# EAGLE design OpenRetroMGB (EAGLE 9.6.2)

## Sheet 1 of 8: Game Boy Card Slot
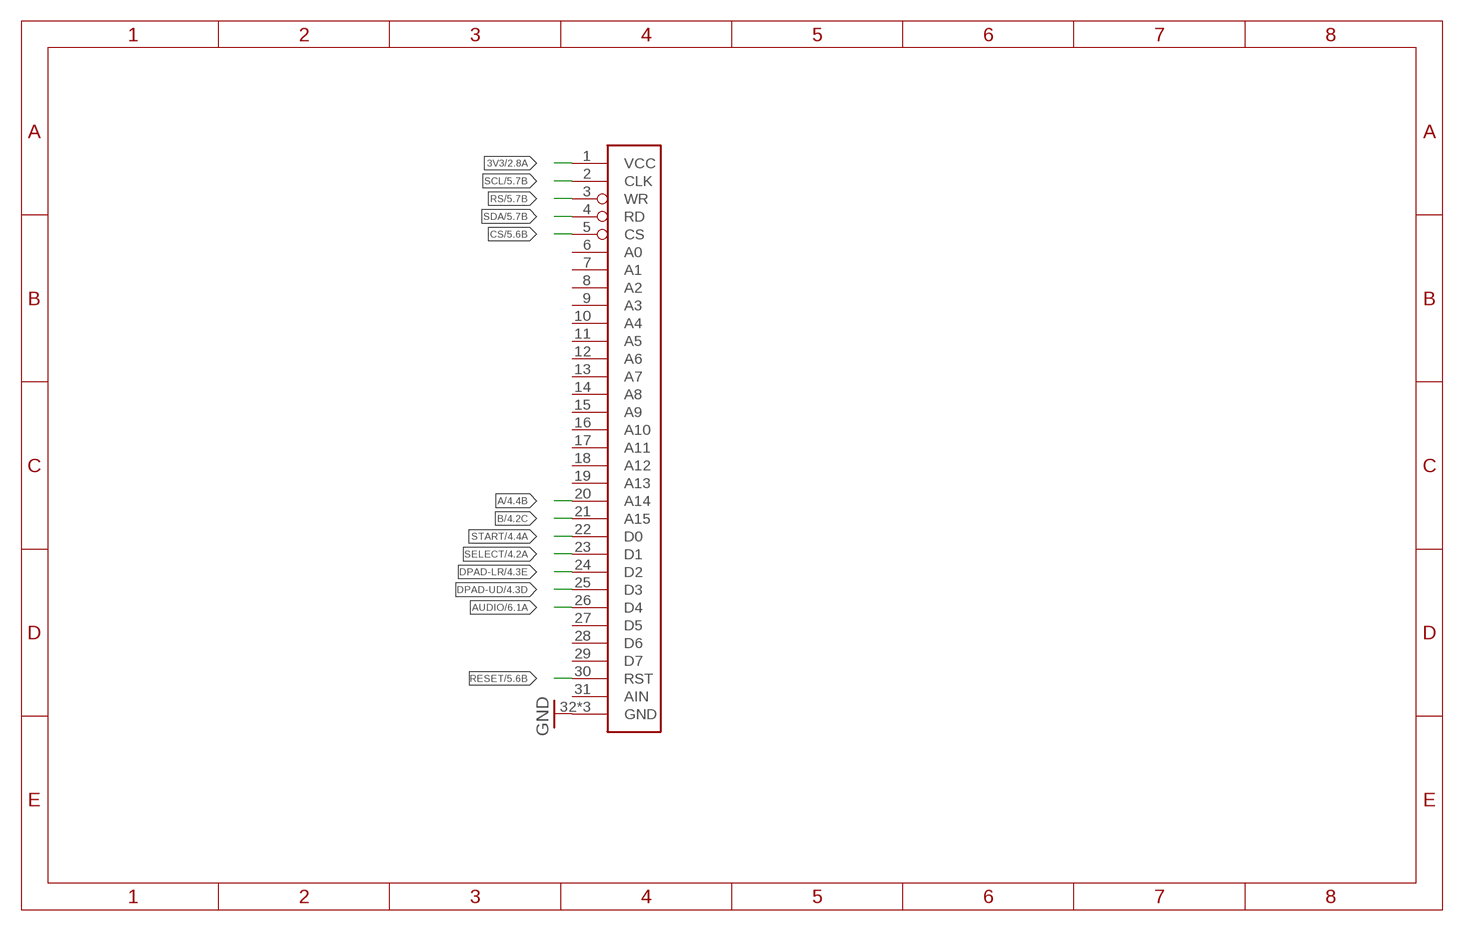
[diagram p0: schematic, sheet 1]

### Parts
U$2  GB-CARTRIDGE-SLOTV2  [GB-CARTRIDGE-SLOT-2]

### Nets
3V3: U$2.1(VCC) ; also sheet 2,4,5,6,7
A: U$2.20(A14) ; also sheet 4
AUDIO: U$2.26(D4) ; also sheet 6
B: U$2.21(A15) ; also sheet 4
CS: U$2.5(CS) ; also sheet 5
DPAD-LR: U$2.24(D2) ; also sheet 4
DPAD-UD: U$2.25(D3) ; also sheet 4
GND: U$2.32(GND) U$2.PAD1(GND) U$2.PAD2(GND) ; also sheet 2,3,4,5,6,7
RESET: U$2.30(RST) ; also sheet 5
RS: U$2.3(WR) ; also sheet 5
SCL: U$2.2(CLK) ; also sheet 5
SDA: U$2.4(RD) ; also sheet 5
SELECT: U$2.23(D1) ; also sheet 4
START: U$2.22(D0) ; also sheet 4
Unconnected: U$2.6(A0) U$2.7(A1) U$2.8(A2) U$2.9(A3) U$2.10(A4) U$2.11(A5) U$2.12(A6) U$2.13(A7) U$2.14(A8) U$2.15(A9) U$2.16(A10) U$2.17(A11) U$2.18(A12) U$2.19(A13) U$2.27(D5) U$2.28(D6) U$2.29(D7) U$2.31(AIN)

## Sheet 2 of 8: POWER (SOURCE, BATTERY, CHARGE, CONTROL)
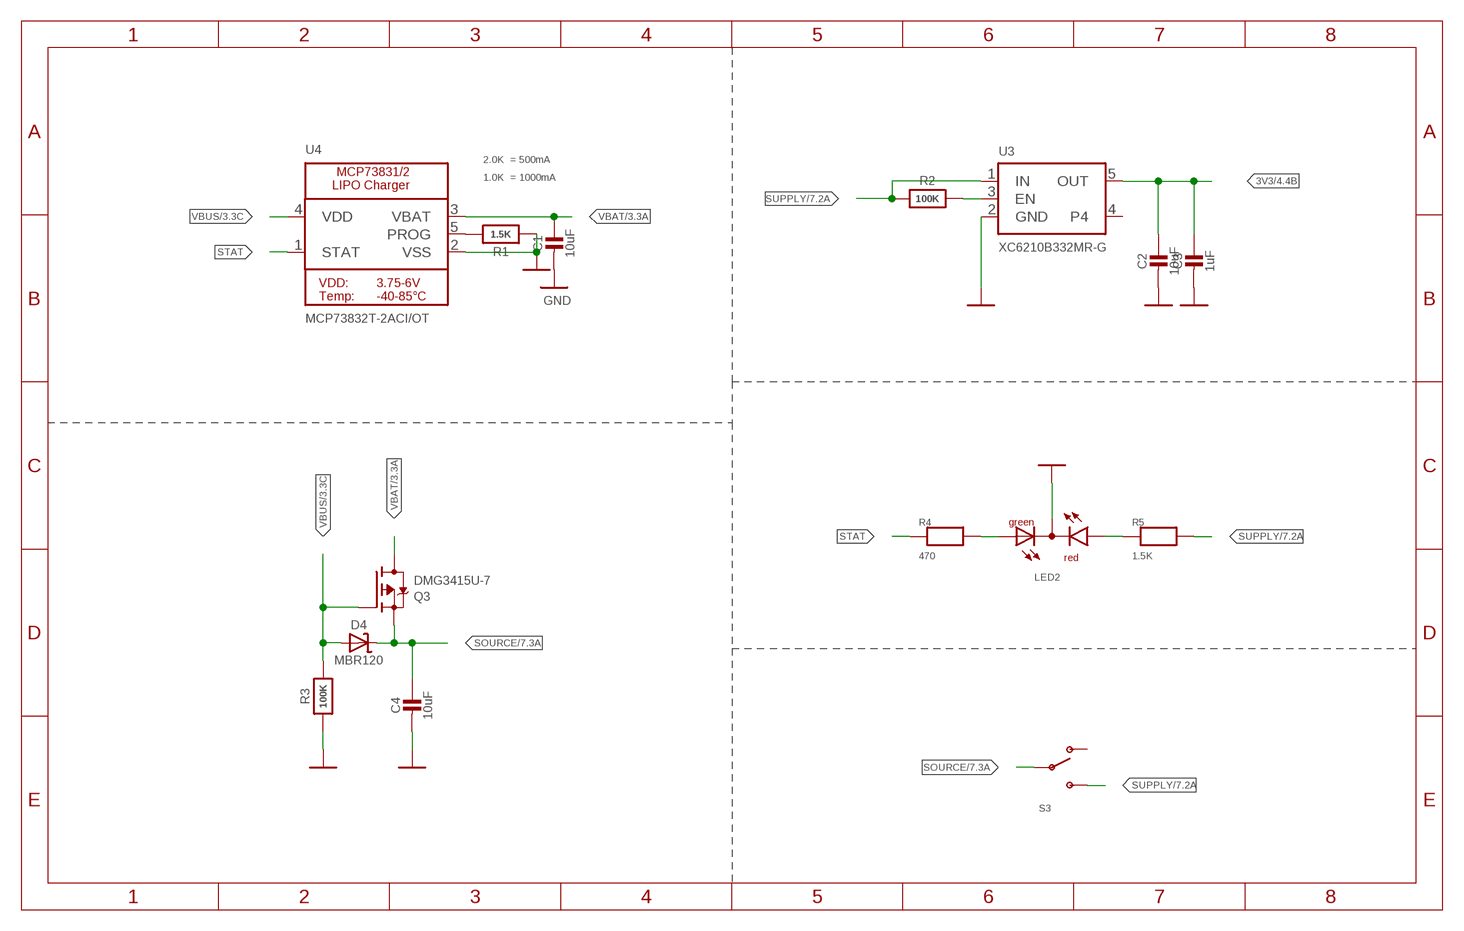
[diagram p1: schematic, sheet 2]

### Parts
C1  10uF  CAP_CERAMIC  [0603-MINI-CAP]
C2  10uF  CAP_CERAMIC  [0603-MINI-CAP]
C3  1uF  CAP_CERAMIC  [0603-MINI-CAP]
C4  10uF  CAP_CERAMIC  [0603-MINI-CAP]
D4  MBR120  DIODE-SCHOTTKYSOD-123  [SOD-123]
LED2  LED_L-115WEGW-CA  [LED_DUOLED-A-3MM]
Q3  DMG3415U-7  MOSFET-P  [SOT23-R]
R1  1.5K  RESISTOR0603MINI  [0603-MINI]
R2  100K  RESISTOR0603MINI  [0603-MINI]
R3  100K  RESISTOR0603MINI  [0603-MINI]
R4  470  RESISTOR0603MINI  [0603-MINI]
R5  1.5K  RESISTOR0603MINI  [0603-MINI]
S3  RETIRED_SWITCH_SPDT  [RETIRED_KPS-1290]
U3  XC6210B332MR-G  AP2112-3.3  [SOT23-5]
U4  MCP73832T-2ACI/OT  MCP73831/2  [SOT23-5-1]

### Nets
3V3: C2.1 C3.1 U3.5(OUT) ; also sheet 1,4,5,6,7
EN: R2.2 U3.3(EN)
GND: C1.2 C2.2 C3.2 C4.2 LED2.2(A) R1.1 R3.1 U3.2(GND) U4.2(VSS) ; also sheet 1,3,4,5,6,7
POWER_LED: LED2.3(CR) R5.1
PROG: R1.2 U4.5(PROG)
SOURCE: C4.1 D4.C Q3.2(S) S3.P ; also sheet 7
STAT: R4.1 U4.1(STAT)
STAT_LED: LED2.1(CG) R4.2
SUPPLY: R2.1 R5.2 S3.S U3.1(IN) ; also sheet 7
VBAT: C1.1 Q3.3(D) U4.3(VBAT) ; also sheet 3,7
VBUS: D4.A Q3.1(G) R3.2 U4.4(VDD) ; also sheet 3,7
Unconnected: S3.O U3.4

### Notes on the sheet
- 2.0K  = 500mA
- 1.0K  = 1000mA

## Sheet 3 of 8: USB + BATTERY
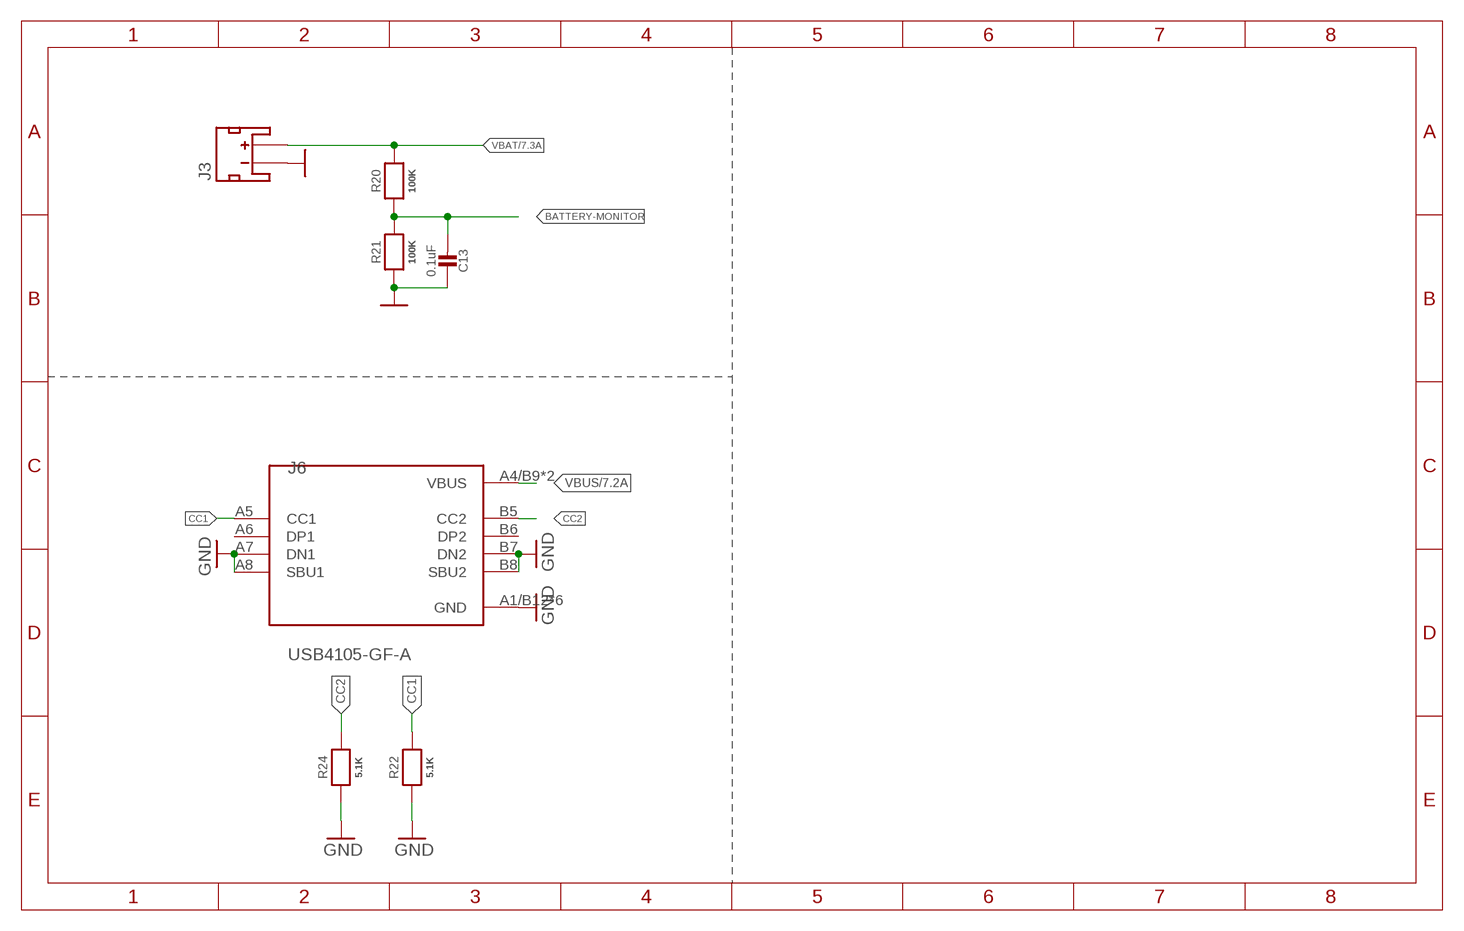
[diagram p2: schematic, sheet 3]

### Parts
C13  0.1uF  CAP_CERAMIC  [0603-MINI-CAP]
J3  Batt Conn  JST_2MM_MALE  [JST-2-SMD]
J6  USB4105-GF-A  [GCT_USB4105-GF-A]
R20  100K  RESISTOR0603MINI  [0603-MINI]
R21  100K  RESISTOR0603MINI  [0603-MINI]
R22  5.1K  RESISTOR0603MINI  [0603-MINI]
R24  5.1K  RESISTOR0603MINI  [0603-MINI]

### Nets
BATTERY-MONITOR: C13.2 R20.1 R21.2
CC1: J6.A5(CC1) R22.2
CC2: J6.B5(CC2) R24.2
GND: C13.1 J3.1(-) J6.A1/B12(GND) J6.A7(DN1) J6.A8(SBU1) J6.B1/A12(GND) J6.B7(DN2) J6.B8(SBU2) J6.G1(GND) J6.G2(GND) J6.G3(GND) J6.G4(GND) R21.1 R22.1 R24.1 ; also sheet 1,2,4,5,6,7
VBAT: J3.2(+) R20.2 ; also sheet 2,7
VBUS: J6.A4/B9(VBUS) J6.B4/A9(VBUS) ; also sheet 2,7
Unconnected: J3.NC1(PAD1) J3.NC2(PAD2) J6.A6(DP1) J6.B6(DP2)

## Sheet 4 of 8: GPIO
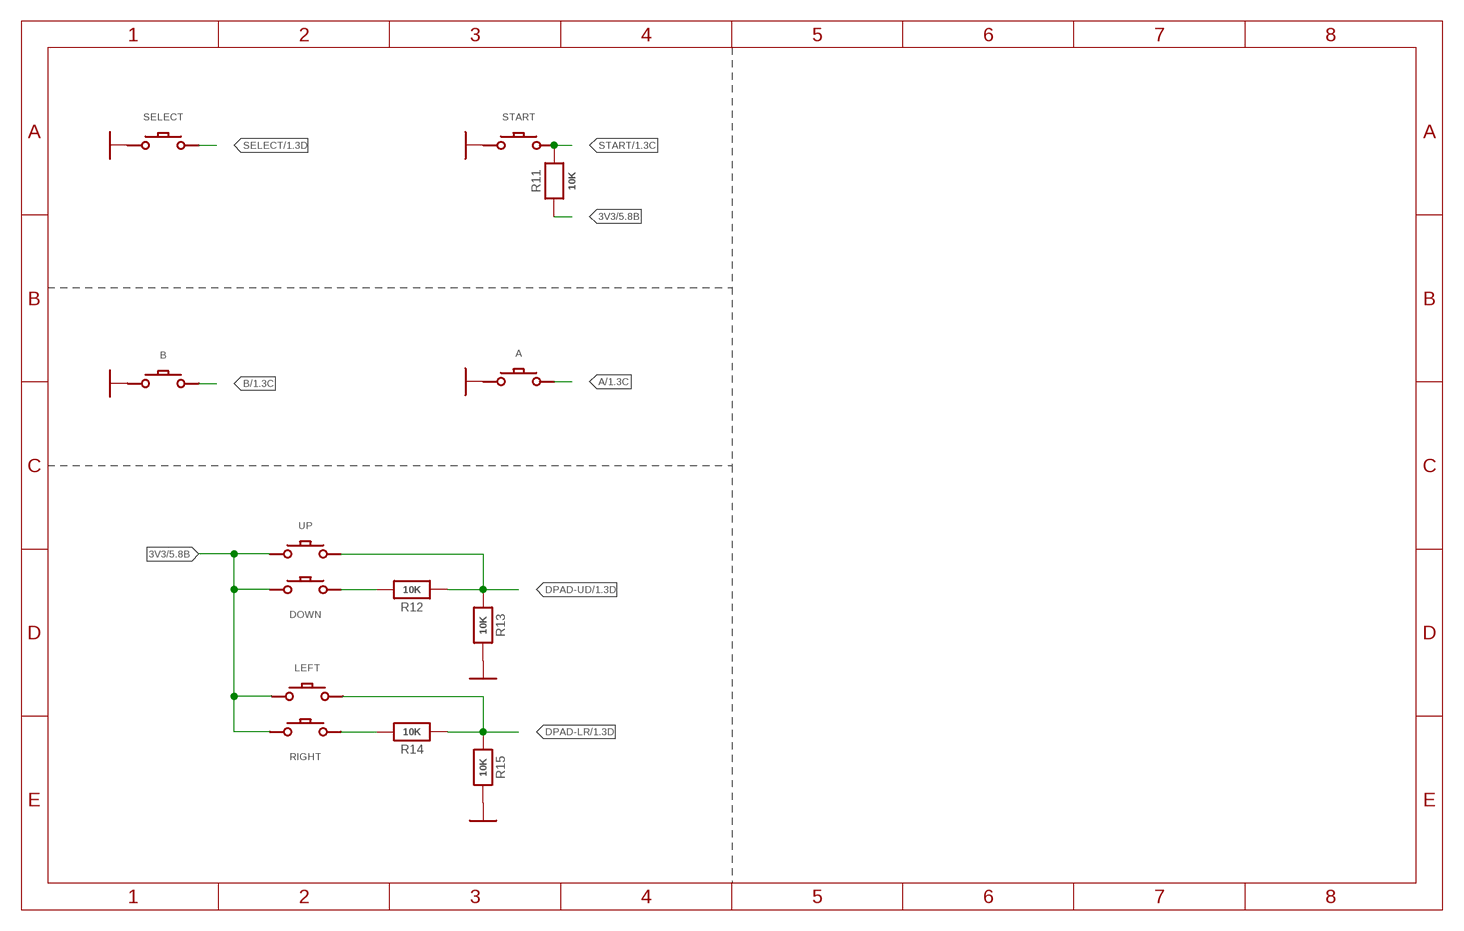
[diagram p3: schematic, sheet 4]

### Parts
A  CONDUCTIVE_BUTTONCONDUCTIVE_BUTTON_MGB  [CONDUCTIVE_BUTTON_MGB]
B  CONDUCTIVE_BUTTONCONDUCTIVE_BUTTON_MGB  [CONDUCTIVE_BUTTON_MGB]
DOWN  CONDUCTIVE_BUTTON  [CONDUCTIVE_BUTTON_DIRECTIONAL]
LEFT  CONDUCTIVE_BUTTON  [CONDUCTIVE_BUTTON_DIRECTIONAL]
R11  10K  RESISTOR0603MINI  [0603-MINI]
R12  10K  RESISTOR0603MINI  [0603-MINI]
R13  10K  RESISTOR0603MINI  [0603-MINI]
R14  10K  RESISTOR0603MINI  [0603-MINI]
R15  10K  RESISTOR0603MINI  [0603-MINI]
RIGHT  CONDUCTIVE_BUTTON  [CONDUCTIVE_BUTTON_DIRECTIONAL]
SELECT  CONDUCTIVE_BUTTON_STARTSELECTCONDUCTIVE_BUTTON_THICK_STARTSELECT  [CONDUCTIVE_BUTTON_THICK_STARTSELECT]
START  CONDUCTIVE_BUTTON_STARTSELECTCONDUCTIVE_BUTTON_THICK_STARTSELECT  [CONDUCTIVE_BUTTON_THICK_STARTSELECT]
UP  CONDUCTIVE_BUTTON  [CONDUCTIVE_BUTTON_DIRECTIONAL]

### Nets
3V3: DOWN.P$GND LEFT.P$GND R11.1 RIGHT.P$GND UP.P$GND ; also sheet 1,2,5,6,7
A: A.P$ACTIVE A.P$ACTIVE1(P$ACTIVE) ; also sheet 1
B: B.P$ACTIVE B.P$ACTIVE1(P$ACTIVE) ; also sheet 1
DOWN: DOWN.P$ACTIVE R12.2
DPAD-LR: LEFT.P$ACTIVE R14.1 R15.1 ; also sheet 1
DPAD-UD: R12.1 R13.1 UP.P$ACTIVE ; also sheet 1
GND: A.P$GND A.P$GND1(P$GND) B.P$GND B.P$GND1(P$GND) R13.2 R15.2 SELECT.P$GND SELECT.P$GND1(P$GND) SELECT.P$GND2(P$GND) SELECT.P$GND3(P$GND) START.P$GND START.P$GND1(P$GND) START.P$GND2(P$GND) START.P$GND3(P$GND) ; also sheet 1,2,3,5,6,7
RIGHT: R14.2 RIGHT.P$ACTIVE
SELECT: SELECT.P$ACTIVE SELECT.P$ACTIVE1(P$ACTIVE) SELECT.P$ACTIVE2(P$ACTIVE) SELECT.P$ACTIVE3(P$ACTIVE) SELECT.P$ACTIVE4(P$ACTIVE) SELECT.P$ACTIVE5(P$ACTIVE) SELECT.P$ACTIVE6(P$ACTIVE) ; also sheet 1
START: R11.2 START.P$ACTIVE START.P$ACTIVE1(P$ACTIVE) START.P$ACTIVE2(P$ACTIVE) START.P$ACTIVE3(P$ACTIVE) START.P$ACTIVE4(P$ACTIVE) START.P$ACTIVE5(P$ACTIVE) START.P$ACTIVE6(P$ACTIVE) ; also sheet 1

## Sheet 5 of 8: SCREEN + BRIGHTNESS
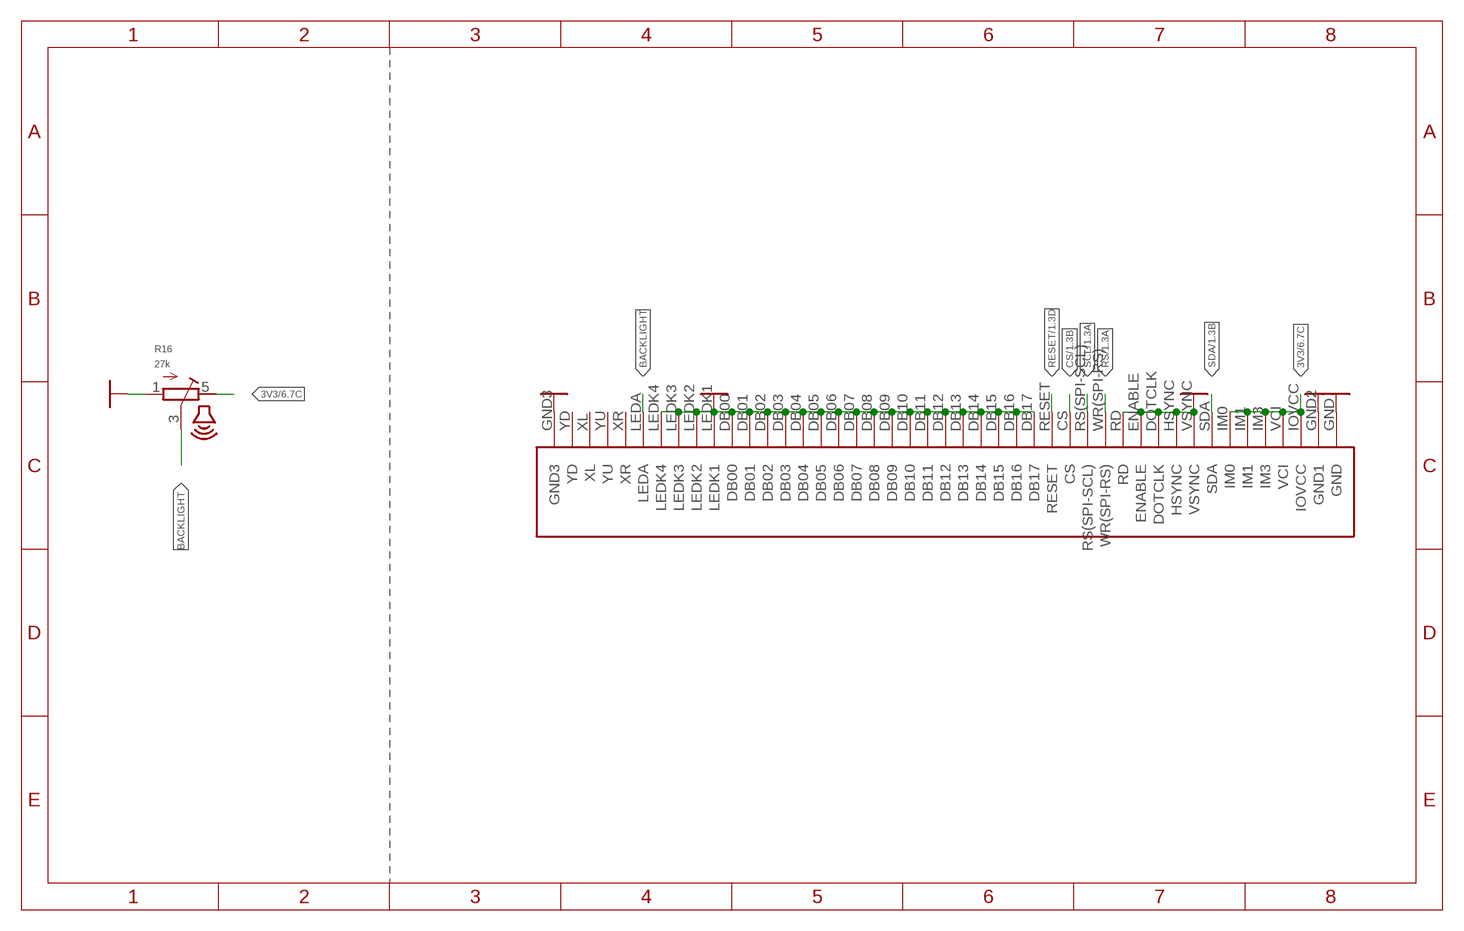
[diagram p4: schematic, sheet 5]

### Parts
R16  27k  THUMBWHEEL  [THUMBWHEEL]
U$11  KD026LQTMA008  [KD026LQTMA008]

### Nets
3V3: R16.5(E) U$11.IM0 U$11.IM1 U$11.IM3 U$11.IOVCC U$11.VCI ; also sheet 1,2,4,6,7
BACKLIGHT: R16.3(S) U$11.LEDA
CS: U$11.CS ; also sheet 1
GND: R16.1(A) U$11.DB00 U$11.DB01 U$11.DB02 U$11.DB03 U$11.DB04 U$11.DB05 U$11.DB06 U$11.DB07 U$11.DB08 U$11.DB09 U$11.DB10 U$11.DB11 U$11.DB12 U$11.DB13 U$11.DB14 U$11.DB15 U$11.DB16 U$11.DB17 U$11.DOTCLK U$11.ENABLE U$11.GND U$11.GND2(GND1) U$11.GND3 U$11.HSYNC U$11.LEDK1 U$11.LEDK2 U$11.LEDK3 U$11.LEDK4 U$11.RD U$11.VSYNC ; also sheet 1,2,3,4,6,7
RESET: U$11.RESET ; also sheet 1
RS: U$11.WR(SPI-RS) ; also sheet 1
SCL: U$11.RS(SPI-SCL) ; also sheet 1
SDA: U$11.SDA ; also sheet 1
Unconnected: U$11.XL U$11.XR U$11.YD U$11.YU

## Sheet 6 of 8: AUDIO
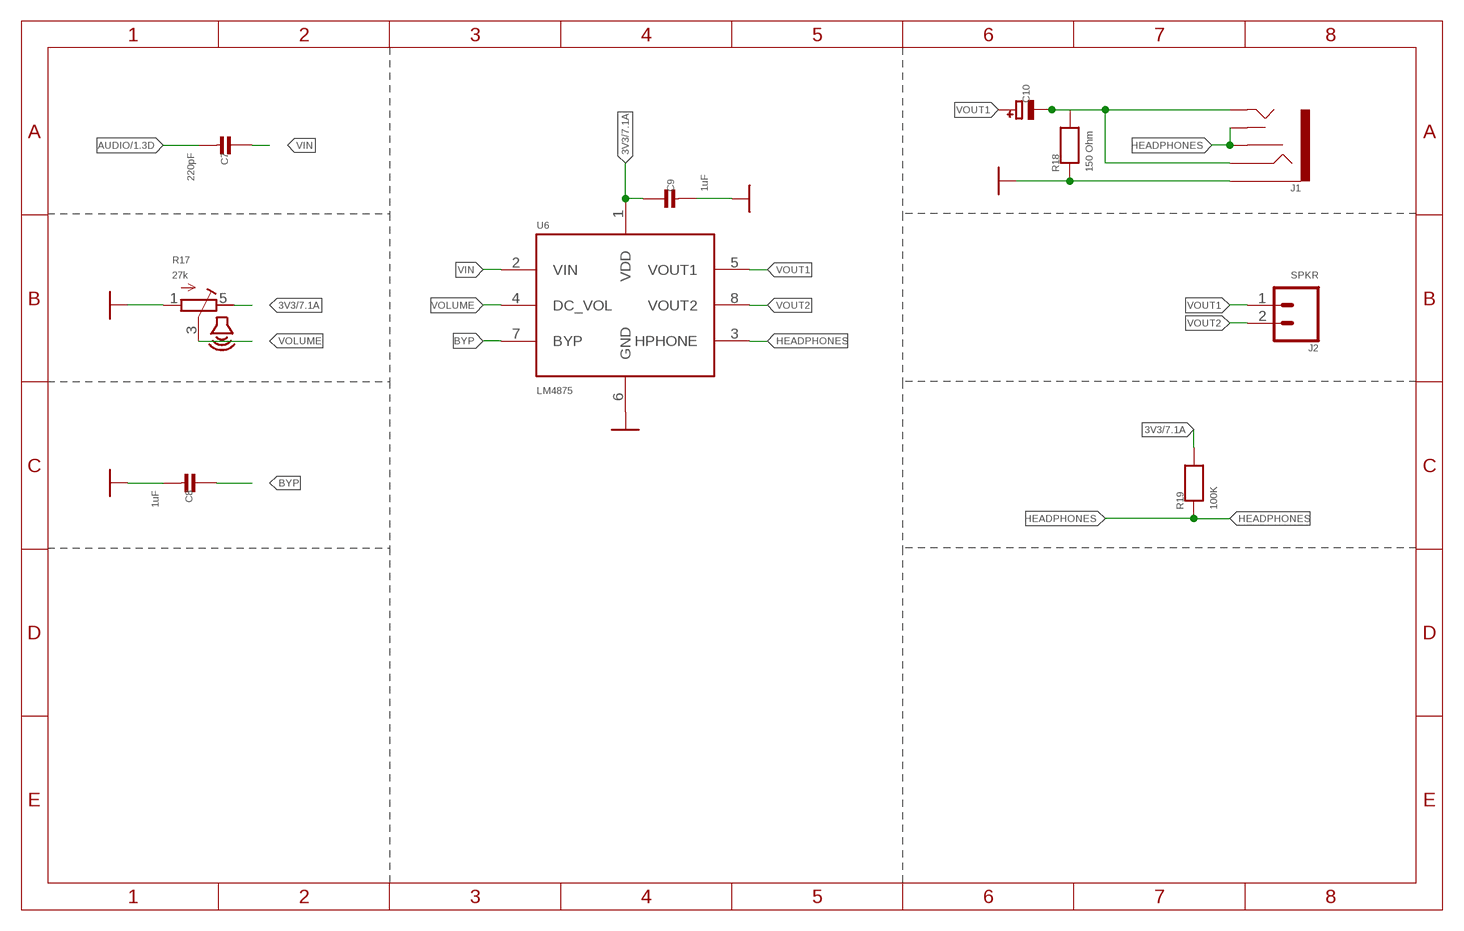
[diagram p5: schematic, sheet 6]

### Parts
C7  220pF  CAP_CERAMIC  [0603-MINI-CAP]
C8  1uF  CAP_CERAMIC  [0603-MINI-CAP]
C9  1uF  CAP_CERAMIC  [0603-MINI-CAP]
C10  100uF  CAP_TANTALUMA/3216_WAVE  [EIA3216-18/A-W]
J1  AUDIO_JACK_3.5MM_KIT  [AUDIO-JACK-KIT]
J2  SPKR  CONN_02  [1X02]
R17  27k  THUMBWHEEL  [THUMBWHEEL]
R18  150 Ohm  RESISTOR0603MINI  [0603-MINI]
R19  100K  RESISTOR0603MINI  [0603-MINI]
U6  LM4875  [SOIC8]

### Nets
3V3: C9.1 R17.5(E) R19.2 U6.1(VDD) ; also sheet 1,2,4,5,7
AUDIO: C7.2 ; also sheet 1
BYP: C8.1 U6.7(BYP)
GND: C8.2 C9.2 J1.SLEEVE R17.1(A) R18.1 U6.6(GND) ; also sheet 1,2,3,4,5,7
HEADPHONES: J1.RSH J1.TSH R19.1 U6.3(HPHONE)
VIN: C7.1 U6.2(VIN)
VIN1: C10.- J1.RING J1.TIP R18.2
VOLUME: R17.3(S) U6.4(DC_VOL)
VOUT1: C10.+ J2.1 U6.5(VOUT1)
VOUT2: J2.2 U6.8(VOUT2)

## Sheet 7 of 8: TEST POINTS
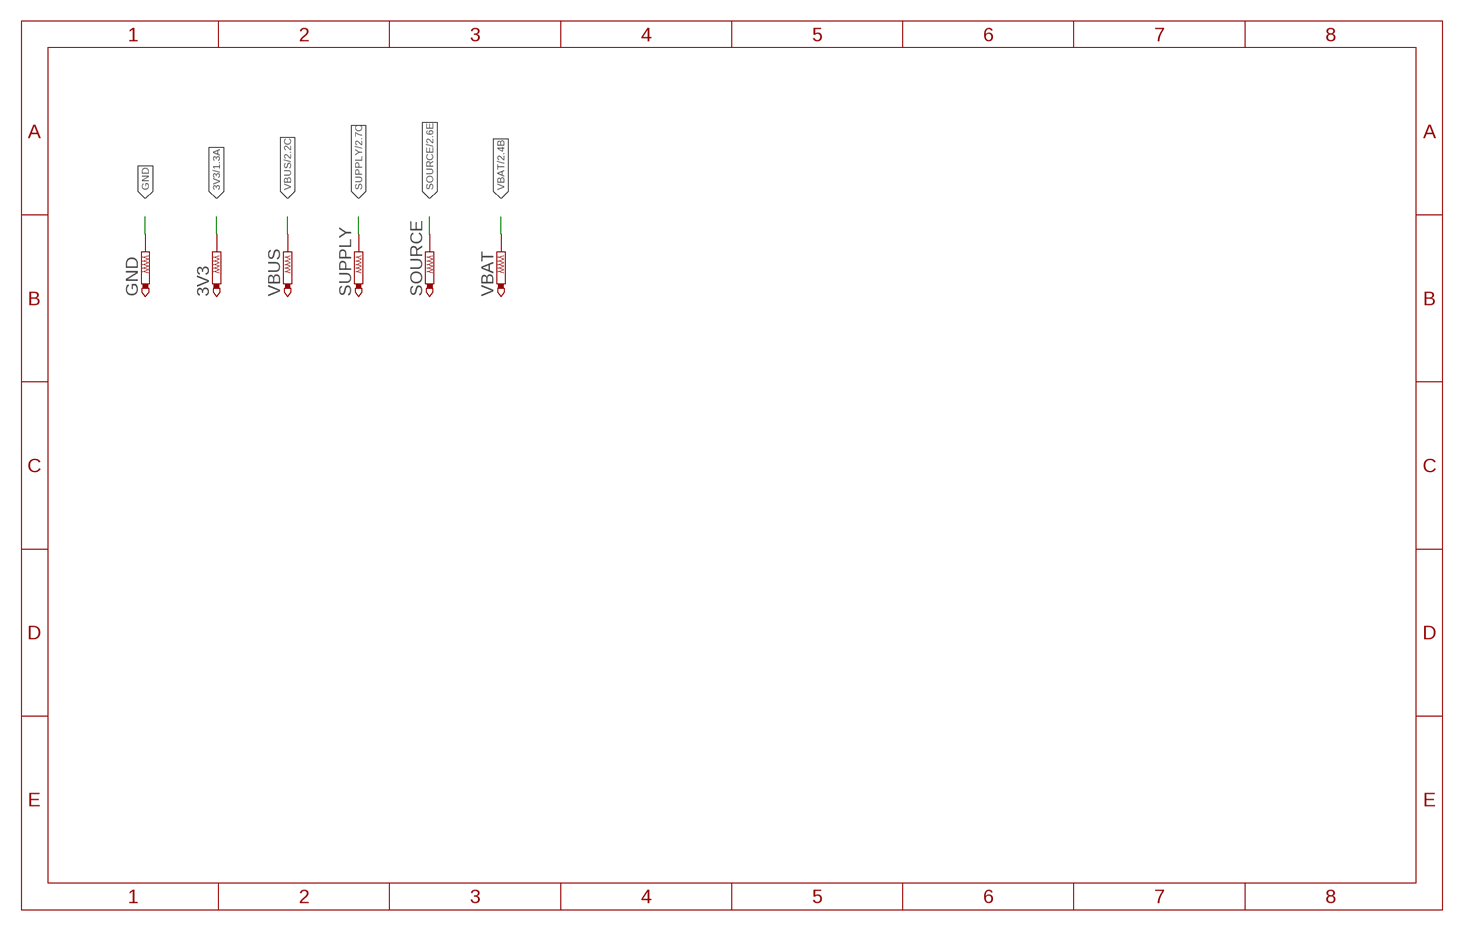
[diagram p6: schematic, sheet 7]

### Parts
3V3  TESTPADTP18R  [TESTPAD]
GND  GND  TESTPADTP18R  [TESTPAD]
SOURCE  TESTPADTP18R  [TESTPAD]
SUPPLY  TESTPADTP18R  [TESTPAD]
VBAT  TESTPADTP18R  [TESTPAD]
VBUS  TESTPADTP18R  [TESTPAD]

### Nets
3V3: 3V3.TP ; also sheet 1,2,4,5,6
GND: GND.TP ; also sheet 1,2,3,4,5,6
SOURCE: SOURCE.TP ; also sheet 2
SUPPLY: SUPPLY.TP ; also sheet 2
VBAT: VBAT.TP ; also sheet 2,3
VBUS: VBUS.TP ; also sheet 2,3

## Sheet 8 of 8: Board and Logos
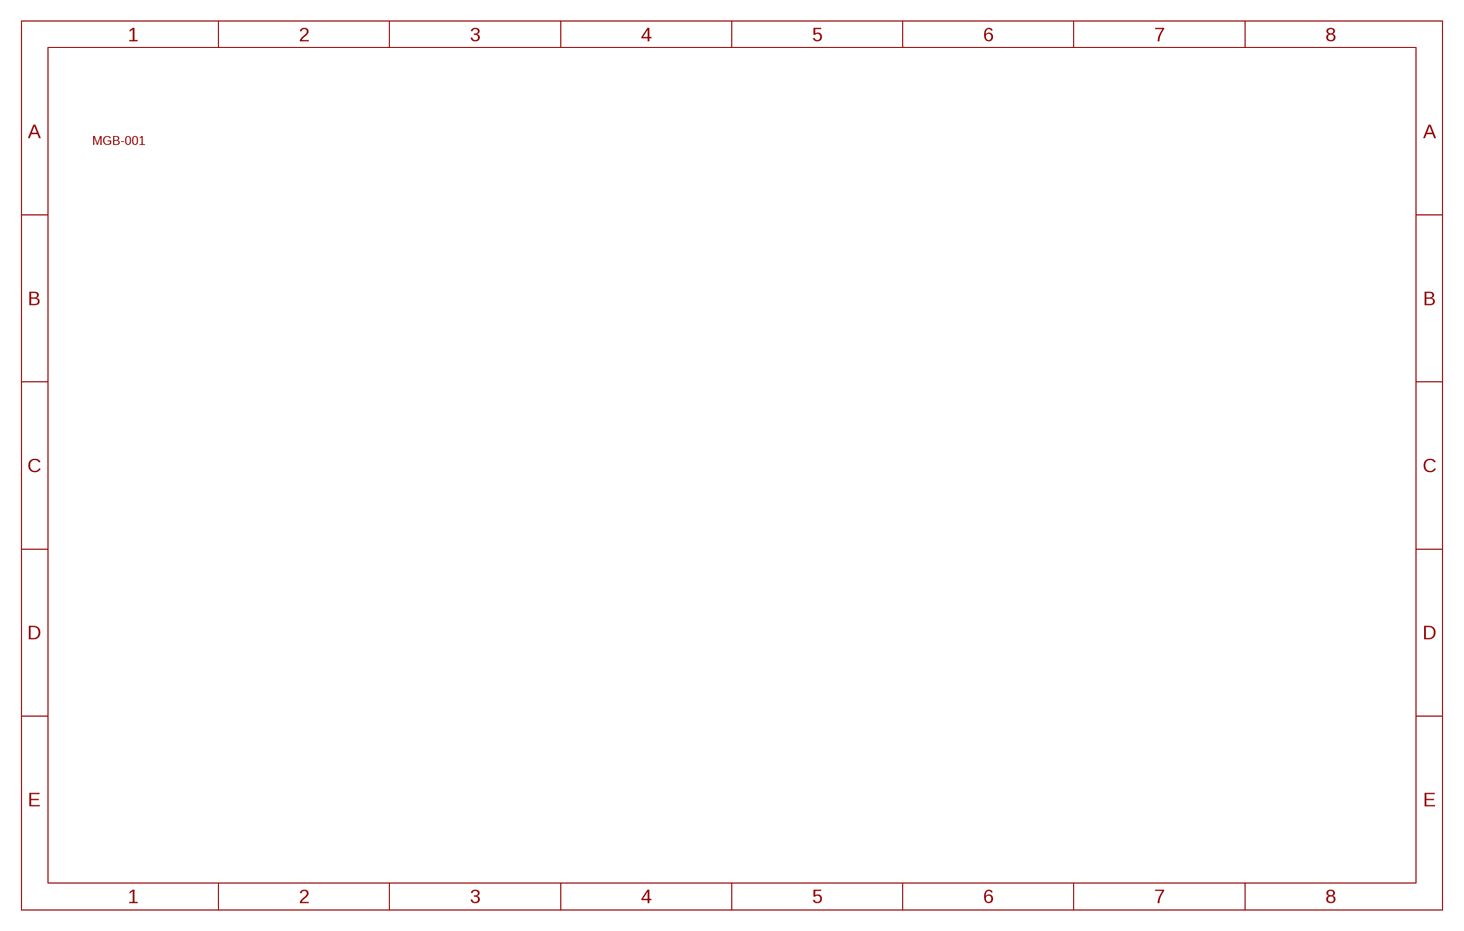
[diagram p7: schematic, sheet 8]

### Parts
U$17  MGB-001  [MGB-001]

## Library data of the parts
3V3 GND SOURCE SUPPLY VBAT VBUS = RetroESP32:TESTPAD: TEST PIN
A DOWN LEFT RIGHT UP = RetroESP32:CONDUCTIVE_BUTTON; IGNORE_BOM: TRUE
B = RetroESP32:CONDUCTIVE_BUTTON; IGNORE_BOM: TRUE; SPICEPREFIX: B
C1 C2 C4 = RetroESP32:CAP_CERAMIC: Ceramic Capacitors For new designs, use the packages preceded by an '_' character since they are more reliable: The following footprints should be used on most boards: _0402 - Standard footprint for regular board layouts _0603 - Standard footprint for regular board layouts _0805 - Standard footprint for regular board layouts _1206 - Standard footprint for regular board layouts For extremely tight-pitch boards where space is at a premium, the following 'micro-pitch' footprints can be used (smaller pads, no silkscreen outline, etc.): _0402MP - Micro-pitch footprint for very dense/compact boards _0603MP - Micro-pitch footprint for very dense/compact boards _0805MP - Micro-pitch footprint for very dense/compact boards _1206MP - Micro-pitch footprint for very dense/compact boards; MPN: CL10A106MP8NNNC
C3 C8 C9 = RetroESP32:CAP_CERAMIC: Ceramic Capacitors For new designs, use the packages preceded by an '_' character since they are more reliable: The following footprints should be used on most boards: _0402 - Standard footprint for regular board layouts _0603 - Standard footprint for regular board layouts _0805 - Standard footprint for regular board layouts _1206 - Standard footprint for regular board layouts For extremely tight-pitch boards where space is at a premium, the following 'micro-pitch' footprints can be used (smaller pads, no silkscreen outline, etc.): _0402MP - Micro-pitch footprint for very dense/compact boards _0603MP - Micro-pitch footprint for very dense/compact boards _0805MP - Micro-pitch footprint for very dense/compact boards _1206MP - Micro-pitch footprint for very dense/compact boards; MPN: CL10A105KP8NNNC
C7 = RetroESP32:CAP_CERAMIC: Ceramic Capacitors For new designs, use the packages preceded by an '_' character since they are more reliable: The following footprints should be used on most boards: _0402 - Standard footprint for regular board layouts _0603 - Standard footprint for regular board layouts _0805 - Standard footprint for regular board layouts _1206 - Standard footprint for regular board layouts For extremely tight-pitch boards where space is at a premium, the following 'micro-pitch' footprints can be used (smaller pads, no silkscreen outline, etc.): _0402MP - Micro-pitch footprint for very dense/compact boards _0603MP - Micro-pitch footprint for very dense/compact boards _0805MP - Micro-pitch footprint for very dense/compact boards _1206MP - Micro-pitch footprint for very dense/compact boards; MPN: CL10C221JB8NNNC
C10 = RetroESP32:CAP_TANTALUM: Tantalum Capacitors Wave footprints have larger pads and are meant to be used for hand soldering. Reflow footprints are optimised for solder paste and a reflow oven. EIA3216-18/A-[R/W] - Size A / 3216-18 / 1206 footprint 4.7µF 25V 10% Tantalum Capacitor 10µF 16V 10% Tantalum Capacitor [Digikey: 495-2236-2-ND] EIA3528-21/B-[R/W] - Size B / 3528-21 47µF 10V 10% Tantalum Capactior [Digikey: 495-2216-1-ND] EIA6032-28/C-[R/W] - Size C / 6032-28 10µF 35V 20% Tantalum Capacitor [Digikey: 495-2285-1-ND] 100µF 16V 10% Tantalum Capactior [Digikey: 399-5214-1-ND]; MPN: F930J107KAA
C13 = RetroESP32:CAP_CERAMIC: Ceramic Capacitors For new designs, use the packages preceded by an '_' character since they are more reliable: The following footprints should be used on most boards: _0402 - Standard footprint for regular board layouts _0603 - Standard footprint for regular board layouts _0805 - Standard footprint for regular board layouts _1206 - Standard footprint for regular board layouts For extremely tight-pitch boards where space is at a premium, the following 'micro-pitch' footprints can be used (smaller pads, no silkscreen outline, etc.): _0402MP - Micro-pitch footprint for very dense/compact boards _0603MP - Micro-pitch footprint for very dense/compact boards _0805MP - Micro-pitch footprint for very dense/compact boards _1206MP - Micro-pitch footprint for very dense/compact boards; MPN: CL10B104KB8NNNC
D4 = RetroESP32:DIODE-SCHOTTKY; MPN: MBR120LSFT1G
J1 = RetroESP32:AUDIO_JACK_3.5MM: Audio Jack 3.5mm variants of PTH and SMT stereo audio jack with bypass switches. SparkFun Products: SparkFun SparkPunk Sound Kit <[https://www.sparkfun.com/products/11177]> - PTH MP3 Trigger <https://www.sparkfun.com/products/13720> -3.5mm SMD SparkFun PicoBoard <https://www.sparkfun.com/products/11888>- 2.5mm SMD; MPN: SJ1-3525NG-GR; PROD_ID: CONN-10353; SF_ID: PRT-08032
J2 = RetroESP32:CONN_02: Multi connection point. Often used as Generic Header-pin footprint for 0.1 inch spaced/style header connections On any of the 0.1 inch spaced packages, you can populate with these: Break Away Headers - Straight <https://www.sparkfun.com/products/116> (PRT-00116) Break Away Male Headers - Right Angle <https://www.sparkfun.com/products/553> (PRT-00553) Female Headers <https://www.sparkfun.com/products/115> (PRT-00115) Break Away Headers - Machine Pin <https://www.sparkfun.com/products/117> (PRT-00117) Break Away Female Headers - Swiss Machine Pin <https://www.sparkfun.com/products/743> (PRT-00743) For SCREWTERMINALS and SPRING TERMINALS visit here: Screw Terimnals on SparkFun.com <https://www.sparkfun.com/search/results?term=Screw+Terminals> (5mm/3.5mm/2.54mm spacing) This device is also useful as a general connection point to wire up your design to another part of your project. Our various solder wires solder well into these plated through hole pads. Hook-Up Wire - Assortment (Stranded, 22 AWG) <https://www.sparkfun.com/products/11375> (PRT-11375) Hook-Up Wire - Assortment (Solid Core, 22 AWG) <https://www.sparkfun.com/products/11367> (PRT-11367) View the entire wire category on our website here <https://www.sparkfun.com/categories/141> Special notes: Molex polarized connector foot print use with: PRT-08233 with associated crimp pins and housings. 2.54_SCREWTERM for use with PRT-10571. 3.5mm Screw Terminal footprints for PRT-08084 5mm Screw Terminal footprints for use with PRT-08432; PROD_ID: CONN-13512; SF_ID: PRT-09918; SF_SKU: PRT-08432; SKU: PRT-09914
J3 = RetroESP32:JST_2MM_MALE: JST 2MM MALE RA CONNECTOR Two pin, compact surface mount connector. Commonly used as a battery input connection point. We really like the solid locking feeling and high current rating on these small connectors. We use these all the time as battery connectors. Mates to single-cell LiPo batteries. Here is the connector we sell at SparkFun: JST Right Angle Connector - White <https://www.sparkfun.com/products/8612> (PRT-08612) Datasheet <http://www.sparkfun.com/datasheets/Prototyping/Connectors/JST-Horizontal.pdf> It was used on these SparkFun products: SparkFun MOSFET Power Controller <https://www.sparkfun.com/products/11214> (PRT-11214) SparkFun Battery Babysitter - LiPo Battery Manager <https://www.sparkfun.com/products/13777> (PRT-13777) And many, many others that required a lipo battery connection.; MPN: S2B-PH-SM4-TB(LF)(SN); PROD_ID: CONN-11443; SF_ID: PRT-08612
J6 = RetroESP32:USB4105-GF-A: USB Type C Receptacle for USB 2.0 SMT Type, PCB Top Mount; AVAILABILITY: Unavailable; DESCRIPTION: USB-C _USB TYPE-C_ USB 2.0 Receptacle Connector 24 _16+8 Dummy_ Position Surface Mount, Right Angle; Through Hole; MF: GCT; MP: USB4105-GF-A; MPN: USB4105-GF-A; PACKAGE: None; PRICE: None
LED2 = RetroESP32:LED_L-115WEGW-CA: T-1(3mm) BI-COLOR INDICATOR LAMP Source: Kingbright .. 2_colour_led_.pdf; MPN: SSL-LX3059IGW
Q3 = RetroESP32:MOSFET-P: P-Channel Mosfet LEGEND VDS: Voltage Drain-Source ID: Drain Current RDS(ON): Drain-Source On-State Resistance VGS(TH): Gate-Source Threshold Voltage CISS: Drain-Source Input Capacitance SOT-23 Name VDS ID RDS(ON) VGS(TH) CISS Order Number IRLML5103 30V 760mA 600 mOhm -- 75pF @ 25V Digikey: IRLML5103PBFCT-ND IRLML6401 12V 4.3A 50 mOhm 950mV @ 250µA 830pF @ 10V Digikey: IRLML6401PBFTR-ND NTR0202PL 20V 400mA 800 mOhm 2.3V @ 250uA 70pF @ 5V Digikey: NTR0202PLT1GOSTR-ND NTR4101PT1G 20V 1.8A 85 mOhm 1.2V @ 250uA 675pF @ 10V Digikey: NTR4101PT1GOSCT-ND DMP2004K 20V 600mA 900 mOhm 1V @ 250uA 175pF @ 16V Digikey: DMP2004KDICT-ND PMV65XP 20V 3.9A 76 mOhm 950mV @ 1mA 725pF @ 20V Digikey: 568-2358-2-ND TO-252 Name VDS ID RDS(ON) VGS(TH) CISS Order Number AOD417 30V 25A 34 mOhm 3V @ 250µA 920pF @ 15V Digikey: 785-1106-2-ND; MPN: DMG3415U-7
R1 R5 = RetroESP32:RESISTOR: Resistors For new designs, use the packages preceded by an '_' character since they are more reliable: The following footprints should be used on most boards: _0402 - Standard footprint for regular board layouts _0603 - Standard footprint for regular board layouts _0805 - Standard footprint for regular board layouts _1206 - Standard footprint for regular board layouts For extremely tight-pitch boards where space is at a premium, the following 'micro-pitch' footprints can be used (smaller pads, no silkscreen outline, etc.): _0402MP - Micro-pitch footprint for very dense/compact boards _0603MP - Micro-pitch footprint for very dense/compact boards _0805MP - Micro-pitch footprint for very dense/compact boards _1206MP - Micro-pitch footprint for very dense/compact boards; MPN: ERJ-PA3J152V
R2 R3 R19-R21 = RetroESP32:RESISTOR: Resistors For new designs, use the packages preceded by an '_' character since they are more reliable: The following footprints should be used on most boards: _0402 - Standard footprint for regular board layouts _0603 - Standard footprint for regular board layouts _0805 - Standard footprint for regular board layouts _1206 - Standard footprint for regular board layouts For extremely tight-pitch boards where space is at a premium, the following 'micro-pitch' footprints can be used (smaller pads, no silkscreen outline, etc.): _0402MP - Micro-pitch footprint for very dense/compact boards _0603MP - Micro-pitch footprint for very dense/compact boards _0805MP - Micro-pitch footprint for very dense/compact boards _1206MP - Micro-pitch footprint for very dense/compact boards; MPN: ERJ-PA3J104V
R4 = RetroESP32:RESISTOR: Resistors For new designs, use the packages preceded by an '_' character since they are more reliable: The following footprints should be used on most boards: _0402 - Standard footprint for regular board layouts _0603 - Standard footprint for regular board layouts _0805 - Standard footprint for regular board layouts _1206 - Standard footprint for regular board layouts For extremely tight-pitch boards where space is at a premium, the following 'micro-pitch' footprints can be used (smaller pads, no silkscreen outline, etc.): _0402MP - Micro-pitch footprint for very dense/compact boards _0603MP - Micro-pitch footprint for very dense/compact boards _0805MP - Micro-pitch footprint for very dense/compact boards _1206MP - Micro-pitch footprint for very dense/compact boards; MPN: ERJ-PA3J471V
R11-R15 = RetroESP32:RESISTOR: Resistors For new designs, use the packages preceded by an '_' character since they are more reliable: The following footprints should be used on most boards: _0402 - Standard footprint for regular board layouts _0603 - Standard footprint for regular board layouts _0805 - Standard footprint for regular board layouts _1206 - Standard footprint for regular board layouts For extremely tight-pitch boards where space is at a premium, the following 'micro-pitch' footprints can be used (smaller pads, no silkscreen outline, etc.): _0402MP - Micro-pitch footprint for very dense/compact boards _0603MP - Micro-pitch footprint for very dense/compact boards _0805MP - Micro-pitch footprint for very dense/compact boards _1206MP - Micro-pitch footprint for very dense/compact boards; MPN: ERJ-PA3J103V
R16 R17 = RetroESP32:THUMBWHEEL
R18 = RetroESP32:RESISTOR: Resistors For new designs, use the packages preceded by an '_' character since they are more reliable: The following footprints should be used on most boards: _0402 - Standard footprint for regular board layouts _0603 - Standard footprint for regular board layouts _0805 - Standard footprint for regular board layouts _1206 - Standard footprint for regular board layouts For extremely tight-pitch boards where space is at a premium, the following 'micro-pitch' footprints can be used (smaller pads, no silkscreen outline, etc.): _0402MP - Micro-pitch footprint for very dense/compact boards _0603MP - Micro-pitch footprint for very dense/compact boards _0805MP - Micro-pitch footprint for very dense/compact boards _1206MP - Micro-pitch footprint for very dense/compact boards; MPN: ERJ-PA3J151V
R22 R24 = RetroESP32:RESISTOR: Resistors For new designs, use the packages preceded by an '_' character since they are more reliable: The following footprints should be used on most boards: _0402 - Standard footprint for regular board layouts _0603 - Standard footprint for regular board layouts _0805 - Standard footprint for regular board layouts _1206 - Standard footprint for regular board layouts For extremely tight-pitch boards where space is at a premium, the following 'micro-pitch' footprints can be used (smaller pads, no silkscreen outline, etc.): _0402MP - Micro-pitch footprint for very dense/compact boards _0603MP - Micro-pitch footprint for very dense/compact boards _0805MP - Micro-pitch footprint for very dense/compact boards _1206MP - Micro-pitch footprint for very dense/compact boards; MPN: ERJ-PA3F5101V
S3 = RetroESP32:RETIRED_SWITCH_SPDT: SWCH-10651 Side-actuated SPDT slide switch, as used on the Arduino Pro; MPN: MA12RTR; PROD_ID: SWITCH SLIDE SPDT 300MA 4V
SELECT START = RetroESP32:CONDUCTIVE_BUTTON_STARTSELECT; IGNORE_BOM: TRUE
U3 = RetroESP32:AP2112-3.3: SOT23-5 Fixed Voltage Regulators To better organise some of the SOT23-5 fixed voltage regulators in this library, this new part was created. Part Current Out V Out V In V Dropout Digikey Part No. ADP121 150mA 3.3V 3.4-5.5V 0.09V @ 150mA ADP121-AUJZ33R7CT-ND ADP121 150mA 3.0V 3.1-5.5V 0.09V @ 150mA ADP121-AUJZ30R7CT-ND ADP122 300mA 3.3V 3.4-5.5V 0.085V @ 300mA ADP122AUJZ-3.3-R7CT-ND ADP1712 300mA 3.3V 3.5-5.5V 0.17V @ 300mA ADP1712AUJZ-3.3-R7TR-ND AP7311 (Low Cost) 150mA 3.3V 3.5-6V 0.15V @ 150mA AP7311-33WG-7DICT-ND LD39015M18R 150mA 1.8V 1.9V-5.5V 0.08V @ 100mA 497-6977-1-ND MCP1824T-3302E/OT 300mA 3.3V 3.5V-6V 0.2V @ 300mA MCP1824T-3302E/OTCT-ND MIC5205-2.5YM5 TR 150mA 2.5V 2.7-16V 0.165V @ 150mA 576-1257-2-ND MIC5205-3.0YM5 TR 150mA 3.0V 3.2V-16V 0.165V @ 150mA 576-1258-2-ND MIC5205-3.3YM5 TR 150mA 3.3V 3.5V-16V 0.165V @ 150mA 576-1259-2-ND TPS780330220 150mA 3.3V+2.2V 3.6-5.5V 250mV Max 296-23332-1-ND TDA3663/N1,135 100mA 3.3V 3.5-45V 0.18V @ 50mA 568-5343-1-ND; MPN: XC6210B332MR-G
U4 = RetroESP32:MCP73831/2: MCP73831/2 LIPO Charger VDD: 3.75 - 6V Temp -40 - 85°C Programmable Charge Rate: 15-500mA NOTE: STAT is a tri-state logic output on the MCP73831 and an open-drain output on the MCP73832. SOT23-5 with 4.2V output and tri-state logic on STAT = MCP73831T-2ACI/OT; MPN: MCP73832T-2ACI/OT
U6 = RetroESP32:LM4875; MPN: LM4875MX/NOPB
U$2 = jrodrigo-gameboy:GB-CARTRIDGE-SLOT
U$11 = RetroESP32:KD026LQTMA008; MPN: 0541324562
U$17 = RetroESP32:MGB-001: MGB-001 Game Boy Pocket This is the footprint and dimensions outline for the Game Boy Pocket PCB Variants MGB-001 - Standard Game Boy Pocket MGB-001-ESP32 - Game Boy Pocket w/ Antenna Cut Out

## Board
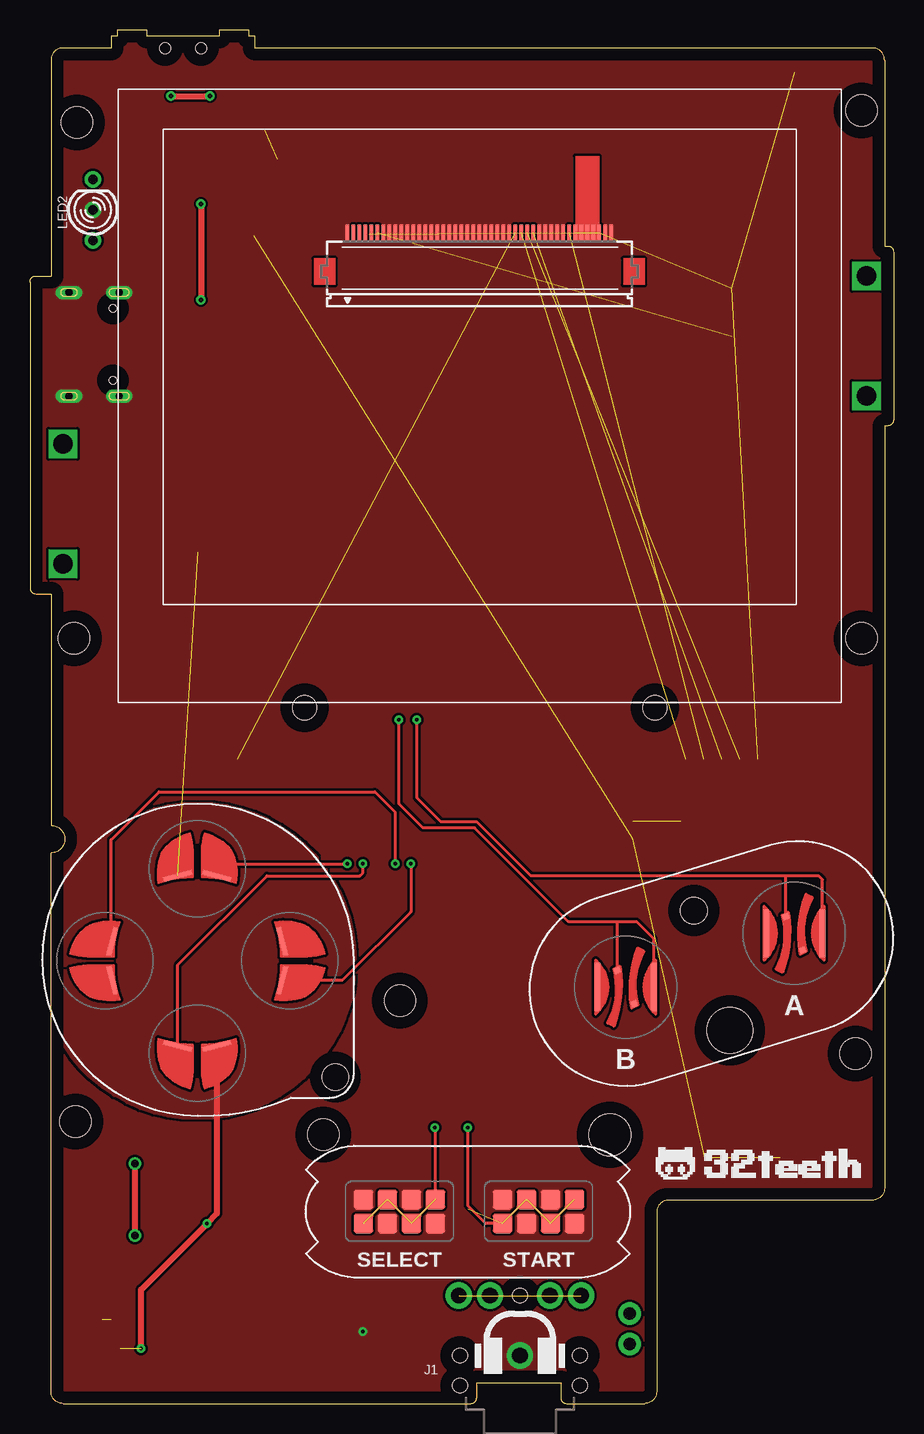
[diagram p8: board, top side]
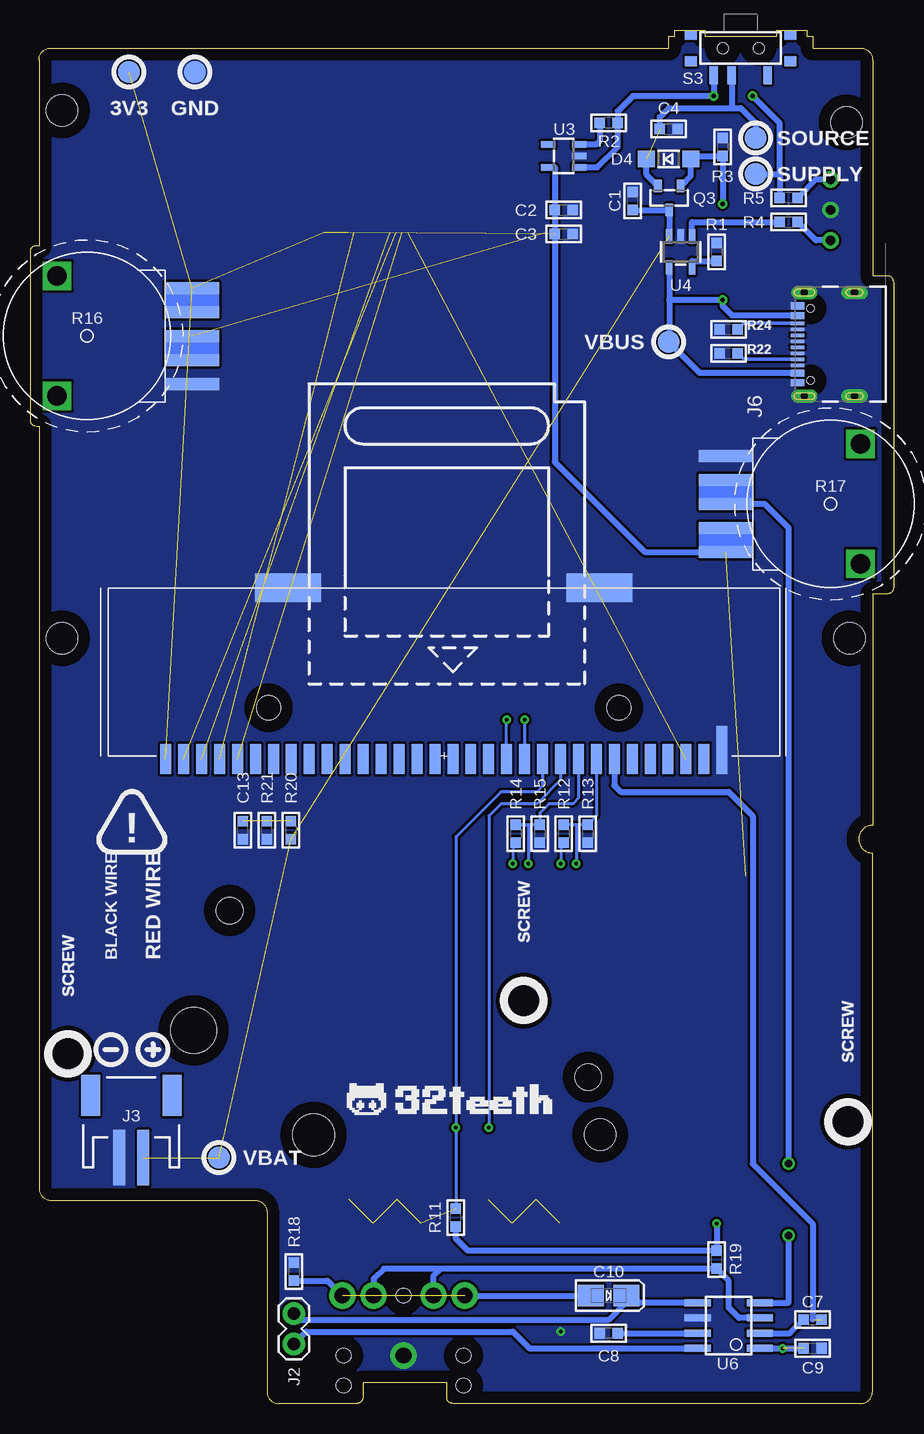
[diagram p9: board, bottom side, seen from below]

Size 72 x 114.5 mm. Coordinates in mm from the lower left corner, seen from the top.
Copper layers (1*16): Top 0.035mm / dielectric 1mm / Bottom 0.035mm
Design rules "default *": minimum track width 10mil, minimum drill 24mil, track to track 8mil, track to pad 8mil, pad to pad 8mil, via to via 8mil, smd to smd 8mil, copper to edge 40mil, drill to drill 8mil, minimum pad ring 10mil, minimum via ring 8mil, stop-mask expansion 5mil, vias tented up to drill 10mil, thermal gap 10mil

### Footprints (pad centres in the part's own frame; a part is rotated, then mirrored left to right if it is on the bottom)
TESTPAD = smd 1.8 x 1.8: TP 0,0
CONDUCTIVE_BUTTON_MGB = smd 0.5 x 4: P$ACTIVE -2.35,0; P$GND 2.35,0 | smd 0.5 x 0.5 rotated 290: P$ACTIVE1 0.7,-1.4 | smd 0.5 x 0.5 rotated 110: P$GND1 -0.7,1.4
0603-MINI-CAP = smd 0.9 x 0.9: 1 -0.75,0; 2 0.75,0
EIA3216-18/A-W = smd 2.15 x 1.8: + 1.475,0; - -1.475,0
SOD-123 = smd 1.4 x 1.4: A 1.85,0; C -1.85,0
CONDUCTIVE_BUTTON_DIRECTIONAL = smd 2.4 x 0.4 rotated 75: P$ACTIVE 0.621,1.623 | smd 2.4 x 0.4 rotated 285: P$GND 0.621,-1.623
AUDIO-JACK-KIT = drill 1.3 pad 2.184: RING 5,5.1; RSH 5,2.5; SLEEVE 0,0; TIP 5,-5.1; TSH 5,-2.5 | hole 1.2: 0,5; -2.5,5; -2.5,-5; 0,-5; 5,0
1X02 = drill 1.016 pad 1.88: 1 0,0; 2 2.54,0
JST-2-SMD = smd 1 x 4.6: 1 -1,-3.7; 2 1,-3.7 | smd 1.6 x 3.4: NC1 -3.4,1.5; NC2 3.4,1.5
GCT_USB4105-GF-A = smd 0.6 x 1.15: A1/B12 -3.2,4.755; A4/B9 -2.4,4.755; B1/A12 3.2,4.755; B4/A9 2.4,4.755 | smd 0.3 x 1.15: A5 -1.25,4.755; A6 -0.25,4.755; A7 0.25,4.755; A8 1.25,4.755; B5 1.75,4.755; B6 0.75,4.755; B7 -0.75,4.755; B8 -1.75,4.755 | drill 0.6 pad 1 long: G1 -4.32,0; G2 4.32,0 | drill 0.6 pad 1.05 long: G3 -4.32,4.18; G4 4.32,4.18 | hole 0.6: 3,3.68; -3,3.68
LED_DUOLED-A-3MM = drill 0.8 pad 1.4: 1 -2.54,0; 2 0,0; 3 2.54,0
SOT23-R = smd 0.635 x 1.016: 1 -0.95,-1; 2 0.95,-1; 3 0,1
0603-MINI = smd 0.9 x 0.9: 1 -0.75,0; 2 0.75,0
THUMBWHEEL = smd 1 x 4.5: 1 -4,-2.25; 2 -2,-2.25; 3 0,-2.25; 4 2,-2.25; 5 4,-2.25 | drill 1.6 square: P$6 -5,9; P$7 5,9
RETIRED_KPS-1290 = smd 0.7 x 1.5: O -2.25,2.25; P 0.75,2.25; S 2.25,2.25 | smd 1 x 0.8: P$1 -4.15,1.1; P$2 -4.15,-1.1; P$3 4.15,-1.1; P$4 4.15,1.1 | hole 0.9: -1.5,0; 1.5,0
CONDUCTIVE_BUTTON_THICK_STARTSELECT = smd 1.6 x 1.6: P$ACTIVE 3,1; P$ACTIVE1 -1,1; P$ACTIVE2 -3,-1; P$ACTIVE3 1,-1; P$GND 1,1; P$GND1 -3,1; P$GND2 -1,-1; P$GND3 3,-1 | smd 2.54 x 0.185 rotated 45: P$ACTIVE4 -2,0 | smd 2.54 x 0.185 rotated 135: P$ACTIVE5 0,0 | smd 2.54 x 0.185 rotated 225: P$ACTIVE6 2,0
SOT23-5 = smd 0.55 x 1.2: 1 -0.95,-1.3; 2 0,-1.3; 3 0.95,-1.3; 4 0.95,1.3; 5 -0.95,1.3
SOT23-5-1 = smd 0.55 x 1.2: 1 -0.95,-1.3; 2 0,-1.3; 3 0.95,-1.3; 4 0.95,1.3; 5 -0.95,1.3
SOIC8 = smd 0.6 x 2.2: 1 -1.905,-2.6; 2 -0.635,-2.6; 3 0.635,-2.6; 4 1.905,-2.6; 5 1.905,2.6; 6 0.635,2.6; 7 -0.635,2.6; 8 -1.905,2.6
GB-CARTRIDGE-SLOT-2 = smd 2.54 x 0.914: 1 -0.27,23.183; 2 -0.27,21.687; 3 -0.27,20.191; 4 -0.27,18.695; 5 -0.27,17.199; 6 -0.27,15.703; 7 -0.27,14.207; 8 -0.27,12.71; 9 -0.27,11.214; 10 -0.27,9.718; 11 -0.27,8.222; 12 -0.27,6.726; 13 -0.27,5.23; 14 -0.27,3.734; 15 -0.27,2.238; 16 -0.27,0.742; 17 -0.27,-0.754; 18 -0.27,-2.25; 19 -0.27,-3.746; 20 -0.27,-5.242; 21 -0.27,-6.738; 22 -0.27,-8.234; 23 -0.27,-9.73; 24 -0.27,-11.226; 25 -0.27,-12.723; 26 -0.27,-14.219; 27 -0.27,-15.715; 28 -0.27,-17.211; 29 -0.27,-18.707; 30 -0.27,-20.203; 31 -0.27,-21.699 | smd 4 x 0.914: 32 0.46,-23.195 | smd 2.4 x 5.5: PAD1 14,12.96; PAD2 14,-12.96 | hole 2: 4,14.606; 4,-14.606
KD026LQTMA008 = smd 0.3 x 1.3: CS 3.47,13.61; DB00 -6.03,13.61; DB01 -5.53,13.61; DB02 -5.03,13.61; DB03 -4.53,13.61; DB04 -4.03,13.61; DB05 -3.53,13.61; DB06 -3.03,13.61; DB07 -2.53,13.61; DB08 -2.03,13.61; DB09 -1.53,13.61; DB10 -1.03,13.61; DB11 -0.53,13.61; DB12 -0.03,13.61; DB13 0.47,13.61; DB14 0.97,13.61; DB15 1.47,13.61; DB16 1.97,13.61; DB17 2.47,13.61; DOTCLK 5.97,13.61; ENABLE 5.47,13.61; GND 10.97,13.61; GND2 10.47,13.61; GND3 -11.03,13.61; HSYNC 6.47,13.61; IM0 7.97,13.61; IM1 8.47,13.61; IM3 8.97,13.61; IOVCC 9.97,13.61; LEDA -8.53,13.61; LEDK1 -6.53,13.61; LEDK2 -7.03,13.61; LEDK3 -7.53,13.61; LEDK4 -8.03,13.61; RD 4.97,13.61; RESET 2.97,13.61; RS(SPI-SCL) 3.97,13.61; SDA 7.47,13.61; VCI 9.47,13.61; VSYNC 6.97,13.61; WR(SPI-RS) 4.47,13.61; XL -10.03,13.61; XR -9.03,13.61; YD -10.53,13.61; YU -9.53,13.61
MGB-001 = hole 2.6: 67.6,107.8; 2.15,106.8; 1.9,63.8; 67.6,63.8; 67.1,29.15; 29.1,33.6; 22.7,22.4; 2.05,23.5 | hole 3.8: 56.6,31.1 | hole 2.2: 53.6,41.1; 23.7,27.2 | hole 3.5: 46.6,22.4

### Placement (x,y rotation side)
3V3  63.75,111 0 bottom
A  63.72,39.2 180 top
B  49.67,34.71 180 top
C1  21.75,100.25 90 bottom
C2  27.5,99.5 0 bottom
C3  27.5,97.5 0 bottom
C4  18.75,106.25 0 bottom
C7  6.75,7 0 bottom
C8  23.75,5.87 180 bottom
C9  6.75,4.59 0 bottom
C10  23.75,9 0 bottom
C13  54.25,47.8 90 bottom
D4  18.75,103.75 0 bottom
DOWN  13.95,29.2 90 top
GND  58.25,111 0 bottom
J1  40.85,4 90 top
J2  50,7.5 270 bottom
J3  63.55,24.2 0 bottom
J6  3.25,88.3 90 bottom
LED2  5.25,99.5 90 top
LEFT  6.25,36.9 0 top
Q3  18.7,100.5 180 bottom
R1  14.75,96 270 bottom
R2  23.75,106.75 180 bottom
R3  14.25,104.75 270 bottom
R4  8.75,98.5 0 bottom
R5  8.75,100.5 180 bottom
R11  36.5,15.5 90 bottom
R12  27.5,47.5 270 bottom
R13  25.5,47.5 270 bottom
R14  31.5,47.5 270 bottom
R15  29.5,47.5 270 bottom
R16  60.75,89 90 bottom
R17  11.75,75 270 bottom
R18  50,11 270 bottom
R19  14.75,12 90 bottom
R20  50.25,47.8 270 bottom
R21  52.25,47.8 90 bottom
R22  13.75,87.55 0 bottom
R24  13.75,89.55 0 bottom
RIGHT  21.65,36.9 180 top
S3  12.75,113 180 bottom
SELECT  30.8,16.01 0 top
SOURCE  11.5,105.5 0 bottom
START  42.41,16.01 0 top
SUPPLY  11.5,102.5 0 bottom
U3  27.5,104 90 bottom
U4  17.75,96 180 bottom
U6  13.75,6.5 90 bottom
U$2  37.5,54 90 bottom
U$11  37.5,84 0 top
U$17  1.75,0 0 top
UP  13.95,44.6 270 top
VBAT  56.25,20.5 0 bottom
VBUS  18.75,88.5 0 bottom

### Tracks (layer width: path | path; a pad name or v marks a point on that pad's centre or on a via)
3V3  (via drill 0.3)  (10 unrouted)
  Top 0.508: DOWN.P$GND 15.57,15.82 v14.75,15 9.25,9.5 v9.25,4.59
  Bottom 0.508: U3.5 28.25,103.05 C2.1 C3.1 28.25,78.5 20.75,71 R17.5 | U6.1 C9.1 | R11.1 36.5,13.75 35.5,12.75 R19.2 v14.75,15
  pour Top (no thermals): 27.05,36.9 arc-90 13.95,23.8 arc-90 0.85,36.9 arc-90 13.95,50 arc-90
A  (via drill 0.3)
  Top 0.254: v32.26,57 32.26,50.49 34.25,48.5 37.25,48.5 41.75,44 62.75,44 63.02,44 | A.P$ACTIVE 66.07,43.68 65.75,44 63.02,44 | A.P$ACTIVE1 63.02,44
  Bottom 0.254: U$2.20 v32.26,57
AUDIO  (1 unrouted)
  Bottom 0.508: 6.75,7 6.75,15 11.75,20 11.75,49 13.75,51 22.75,51 23.28,51.53 U$2.26
B  (via drill 0.3)
  Top 0.254: B.P$ACTIVE 52.02,38.73 50.59,40.16 48.97,40.16 | v30.75,57 30.75,50 32.75,48 37.08,48 44.91,40.16 48.75,40.16 48.97,40.16 | B.P$ACTIVE1 48.97,40.16
  Bottom 0.254: U$2.21 30.75,53.74 v30.75,57
BACKLIGHT  (1 unrouted)
BATTERY-MONITOR  (2 unrouted)
BYP
  Bottom 0.508: C8.1 U6.7
CC1
  Bottom 0.305: J6.A5 12.5,87.05 R22.2
CC2
  Bottom 0.305: J6.B5 12.5,90.05 R24.2
CS  (1 unrouted)
DOWN  (via drill 0.3)
  Top 0.254: DOWN.P$ACTIVE 12.33,36.58 19.75,44 27.5,44 27.75,44.25 v27.75,45
  Bottom 0.254: R12.2 27.75,46.75 v27.75,45
DPAD-LR  (via drill 0.3)
  Top 0.254: LEFT.P$ACTIVE 6.75,38.64 6.75,47 10.75,51 28.75,51 30.45,49.3 v30.45,45
  Bottom 0.254: v30.45,45 30.45,48.25 R14.1 R15.1 29.5,49.25 28.75,50 26.75,50 26.27,50.48 U$2.24
DPAD-UD  (via drill 0.3)
  Top 0.254: UP.P$ACTIVE 16.59,45 v26.45,45
  Bottom 0.254: 26.45,48.25 R13.1 24.78,48.97 U$2.25 | 26.45,48.25 R12.1 | 26.45,48.25 v26.45,45
EN
  Bottom 0.508: R2.2 24.5,105.25 24.8,104.95 U3.3
GND  (via drill 0.3)
  other vias: 27.75,6
  pour Top (rank 2, no thermals): 1.75,0 2.75,0 18.75,0 37.25,0 37.25,1.75 44.25,1.75 44.25,0 52.25,0 52.25,16.95 71.25,16.95 71.25,81.5 72,81.5 72,96.5 71.25,96.5 71.25,113 19.75,113 19.75,114 18.25,114 18.25,114.5 15.75,114.5 15.75,114 9.75,114 9.75,114.5 7.25,114.5 7.25,114 5.75,114 5.75,113 1.75,113 1.75,94 0.75,94 0.75,67.5 1.75,67.5
  pour Bottom (rank 6, no thermals): 1.75,0 2.75,0 18.75,0 37.25,0 37.25,1.75 44.25,1.75 44.25,0 52.25,0 52.25,16.95 71.25,16.95 71.25,81.5 72,81.5 72,96.5 71.25,96.5 71.25,113 19.75,113 19.75,114 18.25,114 18.25,114.5 15.75,114.5 15.75,114 9.75,114 9.75,114.5 7.25,114.5 7.25,114 5.75,114 5.75,113 1.75,113 1.75,94 0.75,94 0.75,67.5 1.75,67.5
HEADPHONES
  Bottom 0.508: U6.3 12.88,7.13 13.75,8 13.75,10.25 R19.1 37.75,11.25 | 37.75,11.25 42.5,11.25 43.35,10.4 J1.TSH | J1.RSH 38.35,10.65 37.75,11.25
POWER_LED
  Bottom 0.508: LED2.3 6.46,102.04 R5.1
PROG
  Bottom 0.508: U4.5 16.8,95.25 R1.2
RESET  (1 unrouted)
RIGHT  (via drill 0.3)
  Top 0.254: v31.75,45 31.75,41 26.03,35.28 RIGHT.P$ACTIVE
  Bottom 0.254: R14.2 31.75,46.75 v31.75,45
RS  (1 unrouted)
SCL  (1 unrouted)
SDA  (1 unrouted)
SELECT  (via drill 0.3)  (6 unrouted)
  Top 0.254: v33.75,23 33.75,17.07 SELECT.P$ACTIVE
  Bottom 0.254: U$2.23 27.77,51.98 29.75,50 32.75,50 33.75,49 v33.75,23
SOURCE  (1 unrouted)
  Bottom 0.508: C4.1 19.5,107.25 18.75,108 13.5,108 | 13.5,108 12.75,108 11.5,106.75 SOURCE.TP | S3.P 13.5,108 | Q3.2 20.6,102.45 D4.C
START  (via drill 0.3)  (7 unrouted)
  Top 0.254: START.P$ACTIVE2 37.99,15.01 36.5,16.5 v36.5,23
  Bottom 0.254: U$2.22 29.27,51.48 29.75,51 32.75,51 36.5,47.25 R11.2
STAT
  Bottom 0.508: U4.1 16.8,98.5 R4.1
STAT_LED
  Bottom 0.508: LED2.1 6.46,96.96 R4.2
SUPPLY  (via drill 0.35)
  Top 0.508: v11.75,109 v15,109
  Bottom 0.508: SUPPLY.TP 9.5,102.5 | 9.5,102.5 R5.2 | 9.5,102.5 9.5,106.75 v11.75,109 | S3.S v15,109 21.75,109 23,107.75 R2.1 23,104.75 24.7,103.05 U3.1
VBAT  (3 unrouted)
  Bottom 0.508: C1.1 Q3.3 U4.3
VBUS  (via drill 0.35)
  Top 0.508: v14.25,100 v14.25,92
  Bottom 0.508: Q3.1 16.9,102.35 D4.A 16.9,104 R3.2 v14.25,100 | U4.4 18.7,92 | 18.7,92 18.7,88.5 VBUS.TP 16.15,85.9 J6.A4/B9 | J6.B4/A9 13.45,90.7 14.25,91.5 v14.25,92 18.7,92
VIN
  Bottom 0.508: U6.2 8.63,5.87 C7.1
VIN1  (via drill 0.61)  (1 unrouted)
  Bottom 0.508: R18.2 47.2,10.25 J1.TIP | J1.RING C10.-
  other vias: 45.95,9
VOLUME  (via drill 0.61)
  Top 0.508: v8.75,14 v8.75,20
  Bottom 0.508: 10.75,8.4 U6.4 8.75,8.4 v8.75,14 | R17.3 10.75,75 8.75,73 v8.75,20
VOUT1
  Bottom 0.508: J2.1 49.5,7 23.75,7 22.27,8.47 C10.+ 21.68,8.4 U6.5
VOUT2
  Bottom 0.508: J2.2 48.96,6 31.75,6 30.34,4.59 U6.8
(copper drawn outside any net)
  shapes: Bottom area x4, Top area x1

### Text on the board
tNames: A | B | SELECT | START
bNames: GND | 3V3 | SOURCE | SUPPLY | VBUS | ! | SCREW | ⇪ | RED WIRE | BLACK WIRE | SCREW | ⇪ | ⇪ | ⇪ | SCREW | ⇪ | VBAT
Reference: Credits: / Name: Eugene Yevhen Andruszczenko / GitHub: 32teeth
mMeasures: Cartridge Top